# Altium schematic sheet SINTETIZADOR Y MEZCLADOR.SchDoc
size A4; SheetNumber: 6; SheetTotal: 7
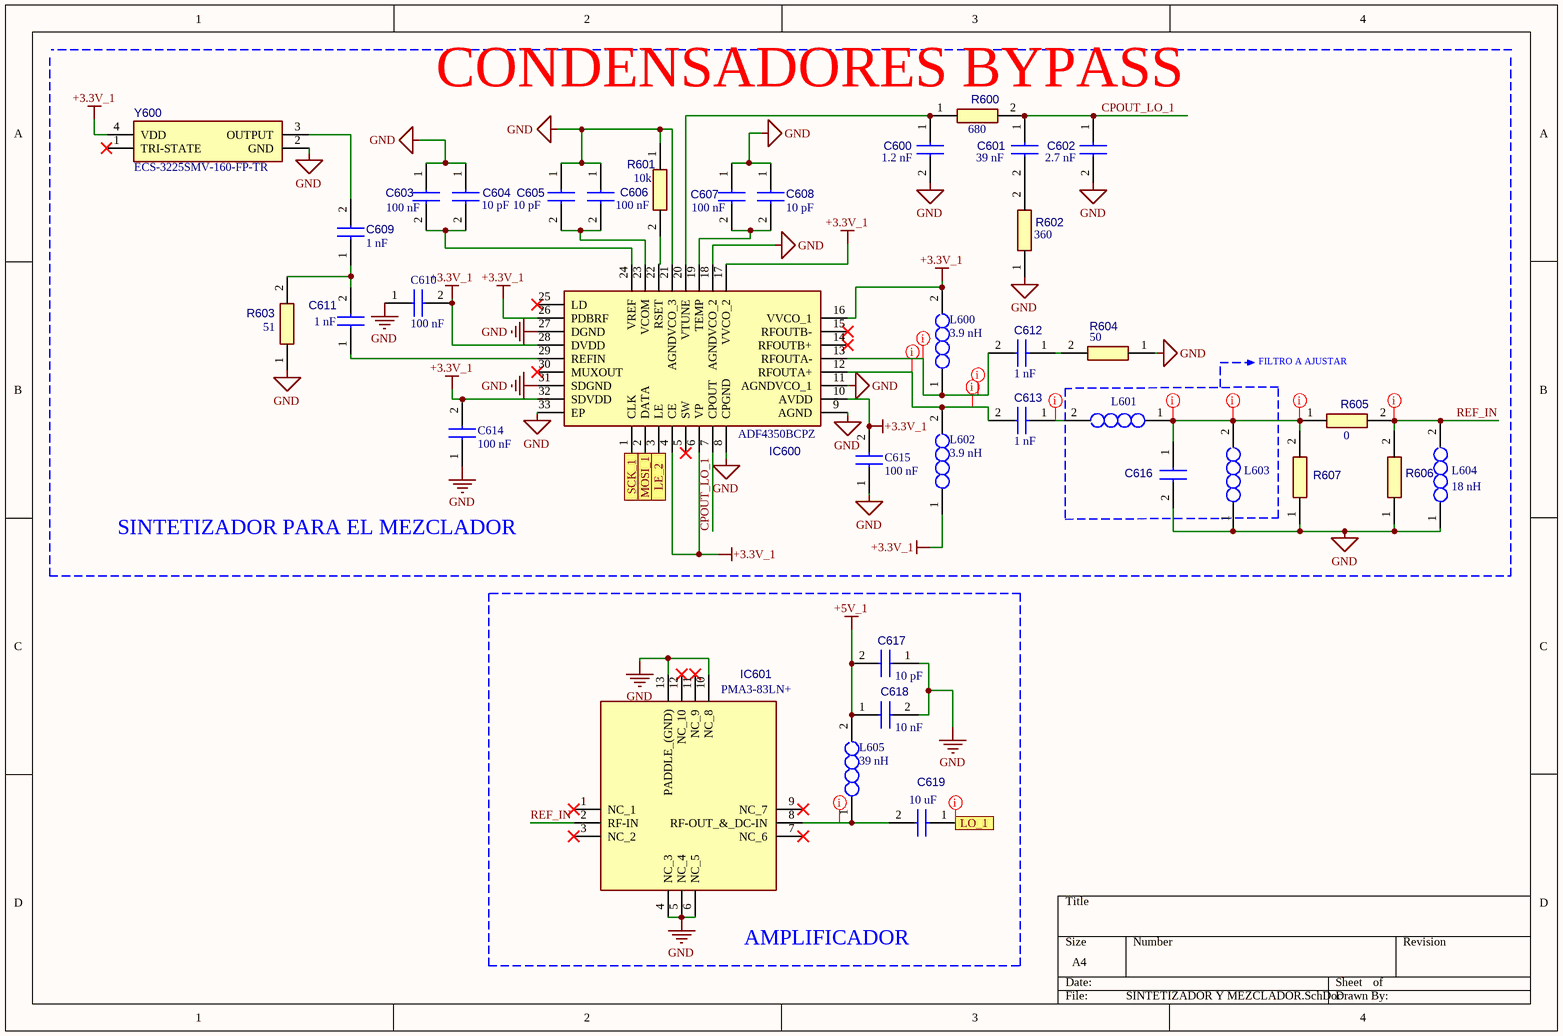
[diagram p0: SINTETIZADOR Y MEZCLADOR.SchDoc]

## Parts
C600  1.2 nF  [C0603]
C601  39 nF  [C0603]
C602  2.7 nF  [C0603]
C603  100 nF  [C0603]
C604  10 pF  [C0603]
C605  10 pF  [C0603]
C606  100 nF  [C0603]
C607  100 nF  [C0603]
C608  10 pF  [C0603]
C609  1 nF  [C0603]
C610  100 nF  [C0603]
C611  1 nF  [C0603]
C612  1 nF  [C0603]
C613  1 nF  [C0603]
C614  100 nF  [C0603]
C615  100 nF  [C0603]
C616  FILTRO  [C0603]  (value not drawn)
C617  10 pF  [C0603]
C618  10 nF  [C0603]
C619  10 uF  [C0603]
IC600  ADF4350BCPZ  [QFN50P500X500X100-33N]
IC601  PMA3-83LN+  [QFN51P300X300X89-13N]
L600  3.9 nH  [INDC1608X95N]
L601  3.9 nH  [INDC1608X95N]  (value not drawn)
L602  3.9 nH  [INDC1608X95N]
L603  3.9 nH  [INDC1608X95N]  (value not drawn)
L604  18 nH  [INDC1608X95N]
L605  39 nH  [INDC1608X95N]
R600  680  [RESC1608X55N]
R601  10k  [RESC1608X55N]
R602  360  [RESC1608X55N]
R603  51  [RESC1608X55N]
R604  50  [RESC1608X55N]
R605  0  [RESC1608X55N]
R606  68  [RESC1608X55N]  (value not drawn)
R607  68  [RESC1608X55N]  (value not drawn)
Y600  ECS-3225SMV-160-FP-TR  [ECS3225SMV160FPTR]

## Blocks framed on the sheet
FILTRO A AJUSTAR: C616 L601 L603
AMPLIFICADOR: C617-C619 IC601 L605

## Ports
LE_2 (in), LO_1 (out), MOSI_1, SCK_1

## Nets
+3.3V_1: C610.2 C614.2 C615.2 IC600.4(CE) IC600.6(VP) IC600.10(AVDD) IC600.16(VVCO_1) IC600.17(VVCO_2) IC600.26(PDBRF) IC600.28(DVDD) IC600.32(SDVDD) L600.2 L602.1 Y600.4(VDD)
+5V_1: C617.2 C618.1 L605.2
GND: C600.2 C602.2 C603.1 C604.1 C605.1 C606.1 C607.1 C608.1 C610.1 C614.1 C615.1 C616.2 C617.1 C618.2 IC600.8(CPGND) IC600.9(AGND) IC600.11(AGNDVCO_1) IC600.18(AGNDVCO_2) IC600.21(AGNDVCO_3) IC600.27(DGND) IC600.31(SDGND) IC600.33(EP) IC601.4(NC_3) IC601.5(NC_4) IC601.6(NC_5) IC601.10(NC_8) IC601.13(PADDLE_(GND)) L603.1 L604.1 R601.1 R602.1 R603.1 R604.1 R606.1 R607.1 Y600.2(GND)
CPOUT_LO_1: C601.1 C602.1 IC600.7(CPOUT) R600.2
LE_2: IC600.3(LE) ; port LE_2
LO_1: C619.1 ; port LO_1
MOSI_1: IC600.2(DATA) ; port MOSI_1
REF_IN: IC601.2(RF-IN) L604.2 R605.2 R606.2
SCK_1: IC600.1(CLK) ; port SCK_1
NetC600_1: C600.1 IC600.20(VTUNE) R600.1
NetC601_2: C601.2 R602.2
NetC603_2: C603.2 C604.2 IC600.24(VREF)
NetC605_2: C605.2 C606.2 IC600.23(VCOM)
NetC607_2: C607.2 C608.2 IC600.19(TEMP)
NetC609_1: C609.1 C611.2 R603.2
NetC609_2: C609.2 Y600.3(OUTPUT)
NetC611_1: C611.1 IC600.29(REFIN)
NetC612_1: C612.1 R604.2
NetC612_2: C612.2 IC600.13(RFOUTA-) L600.1
NetC613_1: C613.1 L601.2
NetC613_2: C613.2 IC600.12(RFOUTA+) L602.2
NetC616_1: C616.1 L601.1 L603.2 R605.1 R607.2
NetC619_2: C619.2 IC601.8(RF-OUT_&_DC-IN) L605.1
NetIC600_22: IC600.22(RSET) R601.2

Not connected (* = marked no-connect by the designer): IC600 5(SW)* 14(RFOUTB+)* 15(RFOUTB-)* 25(LD)* 30(MUXOUT)*; IC601 1(NC_1)* 3(NC_2)* 7(NC_6)* 9(NC_7)* 11(NC_9)* 12(NC_10)*; Y600 1(TRI-STATE)*

## Layout directives
net class RF: LO_1, NetC612_2, NetC613_1, NetC613_2, NetC616_1, NetC619_2, REF_IN

## Notes on the sheet
- (near R600) CONDENSADORES BYPASS
- SINTETIZADOR PARA EL MEZCLADOR

## Library data of the parts
C600-C619 = C0603H470J5GACTU: Capacitor; Manufacturer_Name: KEMET; Datasheet Link: https://content.kemet.com/datasheets/KEM_C1001_C0G_200C_SMD.pdf; Height: 0.87mm; Manufacturer_Part_Number: C0603H470J5GACTU
IC600 = ADF4350BCPZ: Integrated Circuit; Manufacturer_Name: Analog Devices; Datasheet Link: https://datasheet.datasheetarchive.com/originals/distributors/Datasheets-SFU1/DSASFU10004634.pdf; Height: 1mm; Manufacturer_Part_Number: ADF4350BCPZ; Mouser Part Number: 584-ADF4350BCPZ; Mouser Price/Stock: https://www.mouser.co.uk/ProductDetail/Analog-Devices/ADF4350BCPZ?qs=BpaRKvA4VqGt2ZHwONikjQ%3D%3D; Arrow Part Number: ADF4350BCPZ; Arrow Price/Stock: https://www.arrow.com/en/products/adf4350bcpz/analog-devices?region=nac
IC601 = PMA3-83LN+: Integrated Circuit; Manufacturer_Name: Mini-Circuits; Datasheet Link: https://www.minicircuits.com/pdfs/PMA3-83LN+.pdf; Height: 0.89mm; Manufacturer_Part_Number: PMA3-83LN+; Mouser Part Number: 139-PMA3-83LN; Mouser Price/Stock: https://www.mouser.co.uk/ProductDetail/Mini-Circuits/PMA3-83LN%2b?qs=xZ%2FP%252Ba9zWqbScBj7fhbP6Q%3D%3D
L600-L605 = AIML-0603-100K-T: Inductor; Manufacturer_Name: ABRACON; Datasheet Link: https://abracon.com/Magnetics/new/AIML-0603.pdf; Height: 0.95mm; Manufacturer_Part_Number: AIML-0603-100K-T; Mouser Part Number: 815-AIML-0603-100KT; Mouser Price/Stock: https://www.mouser.co.uk/ProductDetail/ABRACON/AIML-0603-100K-T?qs=1vO2EIVe%252BY5tBY%252BpVVThrw%3D%3D; Arrow Part Number: AIML-0603-100K-T; Arrow Price/Stock: https://www.arrow.com/en/products/aiml-0603-100k-t/abracon?region=nac
R600-R607 = CR0603-FX-1431ELF: Resistor; Manufacturer_Name: Bourns; Datasheet Link: https://www.bourns.com/pdfs/chpreztr.pdf; Height: 0.55mm; Manufacturer_Part_Number: CR0603-FX-1431ELF; Mouser Part Number: 652-CR0603FX-1431ELF; Mouser Price/Stock: https://www.mouser.co.uk/ProductDetail/Bourns/CR0603-FX-1431ELF?qs=e7cxVwPieurCzASkAzK2%252Bg%3D%3D
Y600 = ECS-3225SMV-160-FP-TR: Crystal or Oscillator; Manufacturer_Name: ECS; Datasheet Link: https://datasheet.datasheetarchive.com/originals/distributors/Datasheets_SAMA/aca54b4a763fa6b74cd8d2921d99cf9f.pdf; Height: 1.2mm; Manufacturer_Part_Number: ECS-3225SMV-160-FP-TR; Mouser Part Number: 520-3225SMV-160-FPT; Mouser Price/Stock: https://www.mouser.co.uk/ProductDetail/ECS/ECS-3225SMV-160-FP-TR?qs=%252B6g0mu59x7IhPTRSFb%2Fsjg%3D%3D; Arrow Part Number: ECS-3225SMV-160-FP-TR; Arrow Price/Stock: https://www.arrow.com/en/products/ecs-3225smv-160-fp-tr/ecs-international?region=nac